# Altium project dose_io.PrjPCB
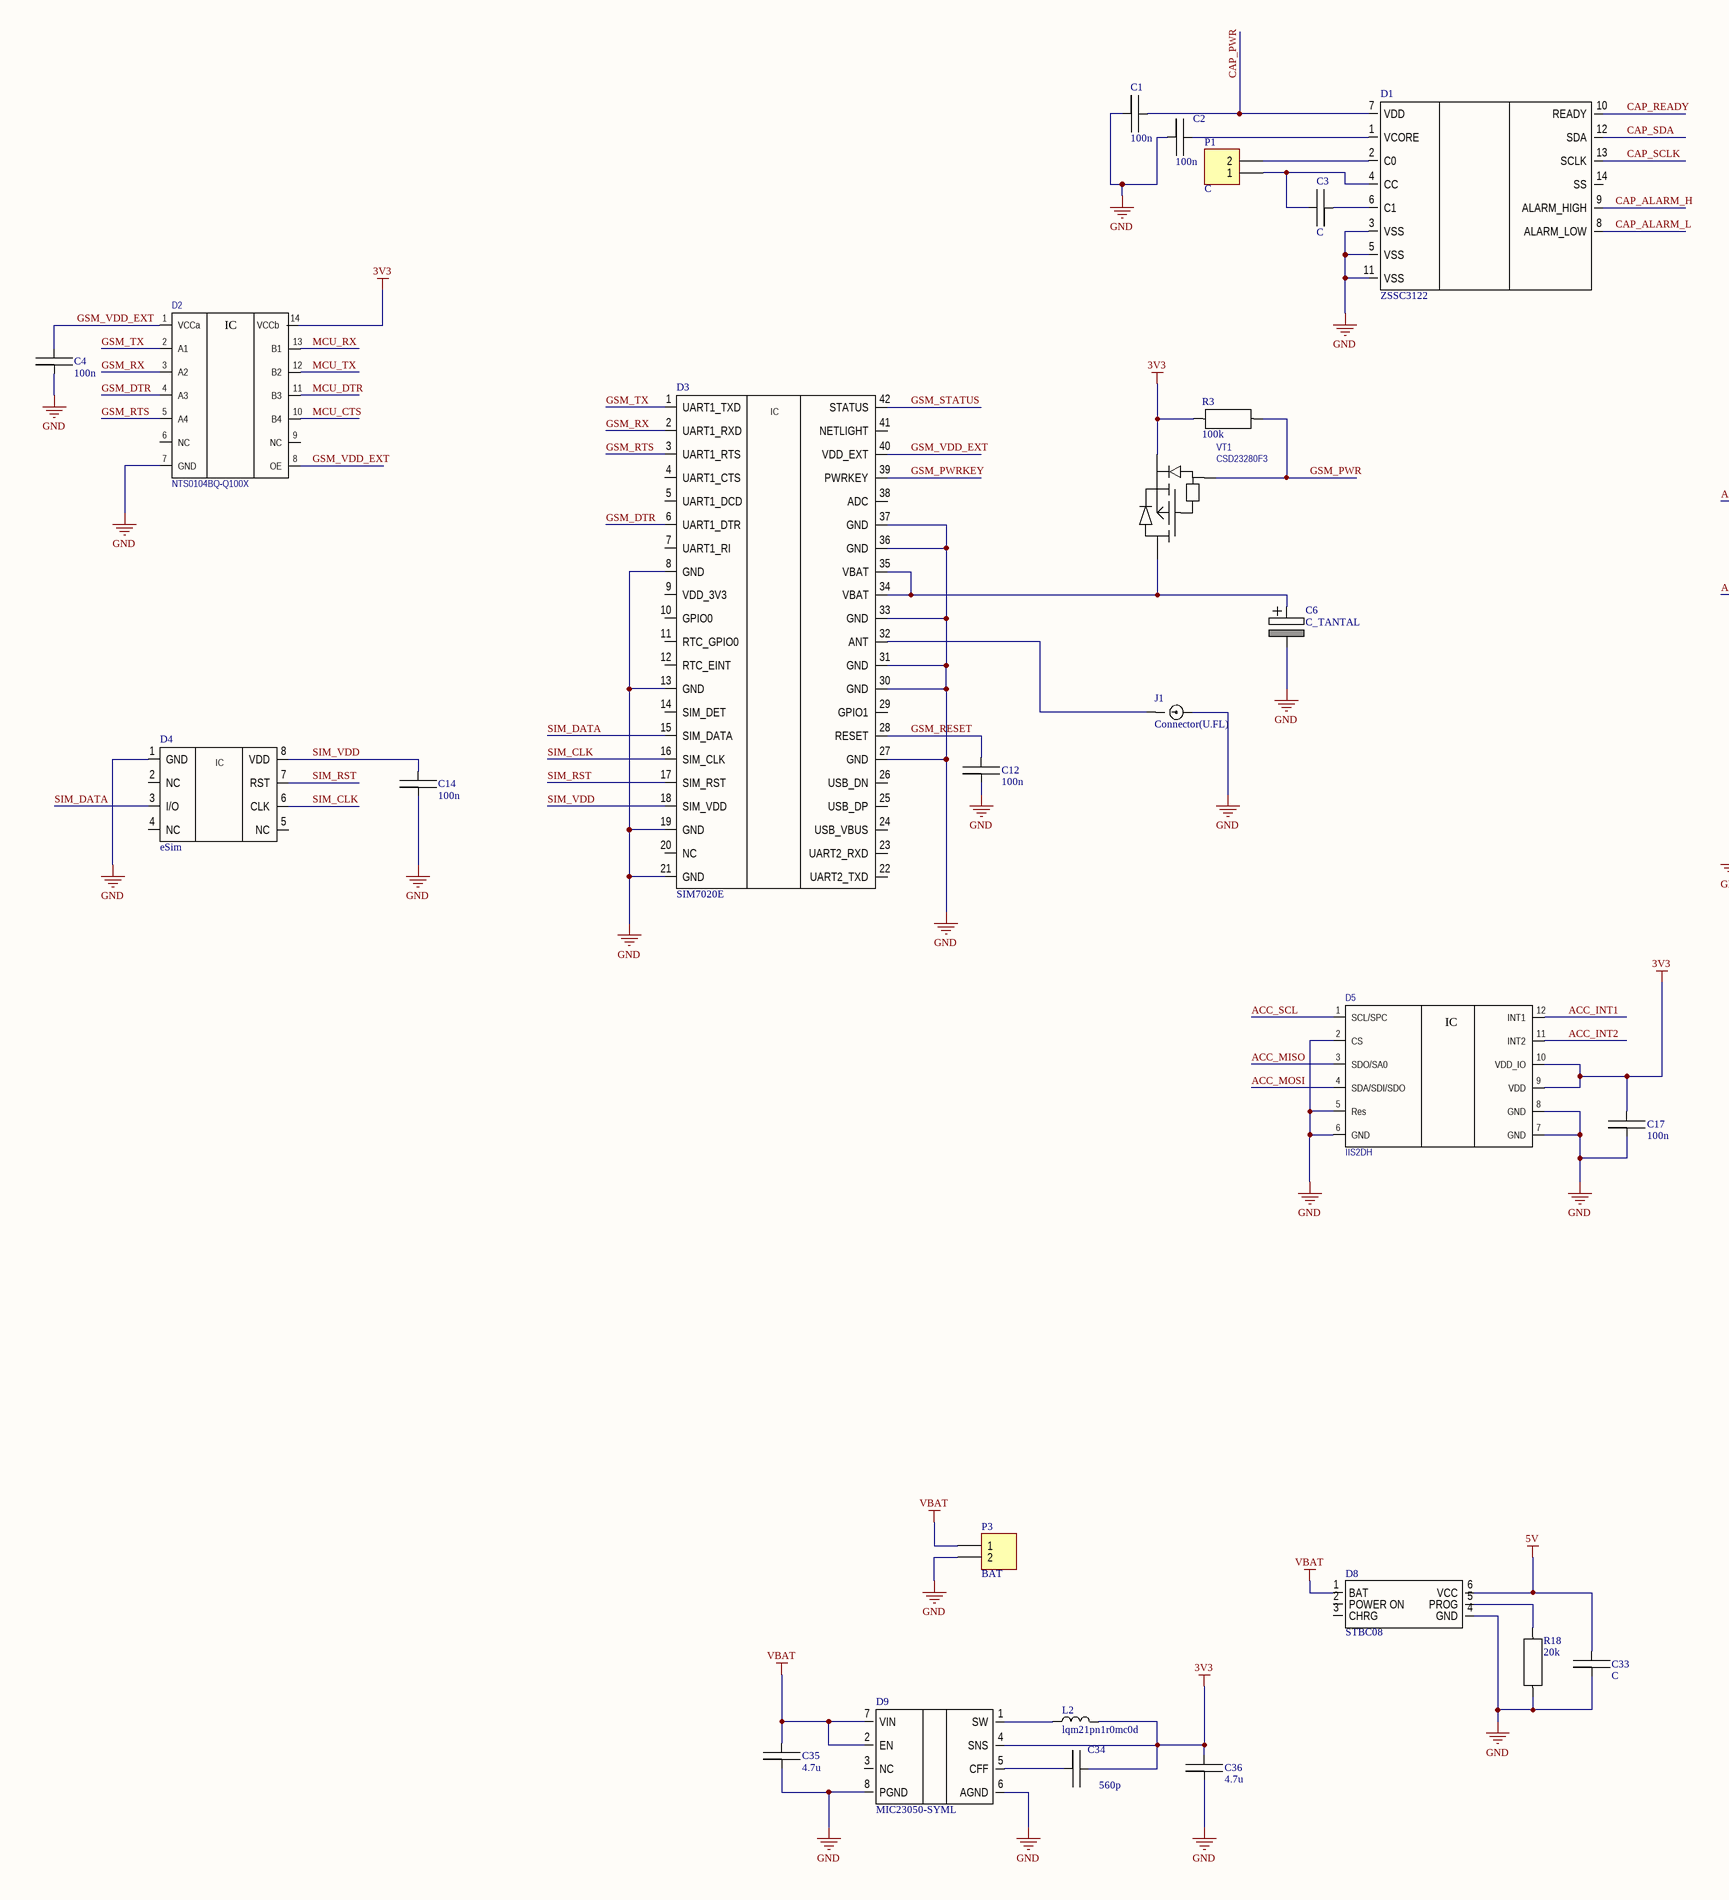
[diagram p0: Sheet_v1.SchDoc, left]
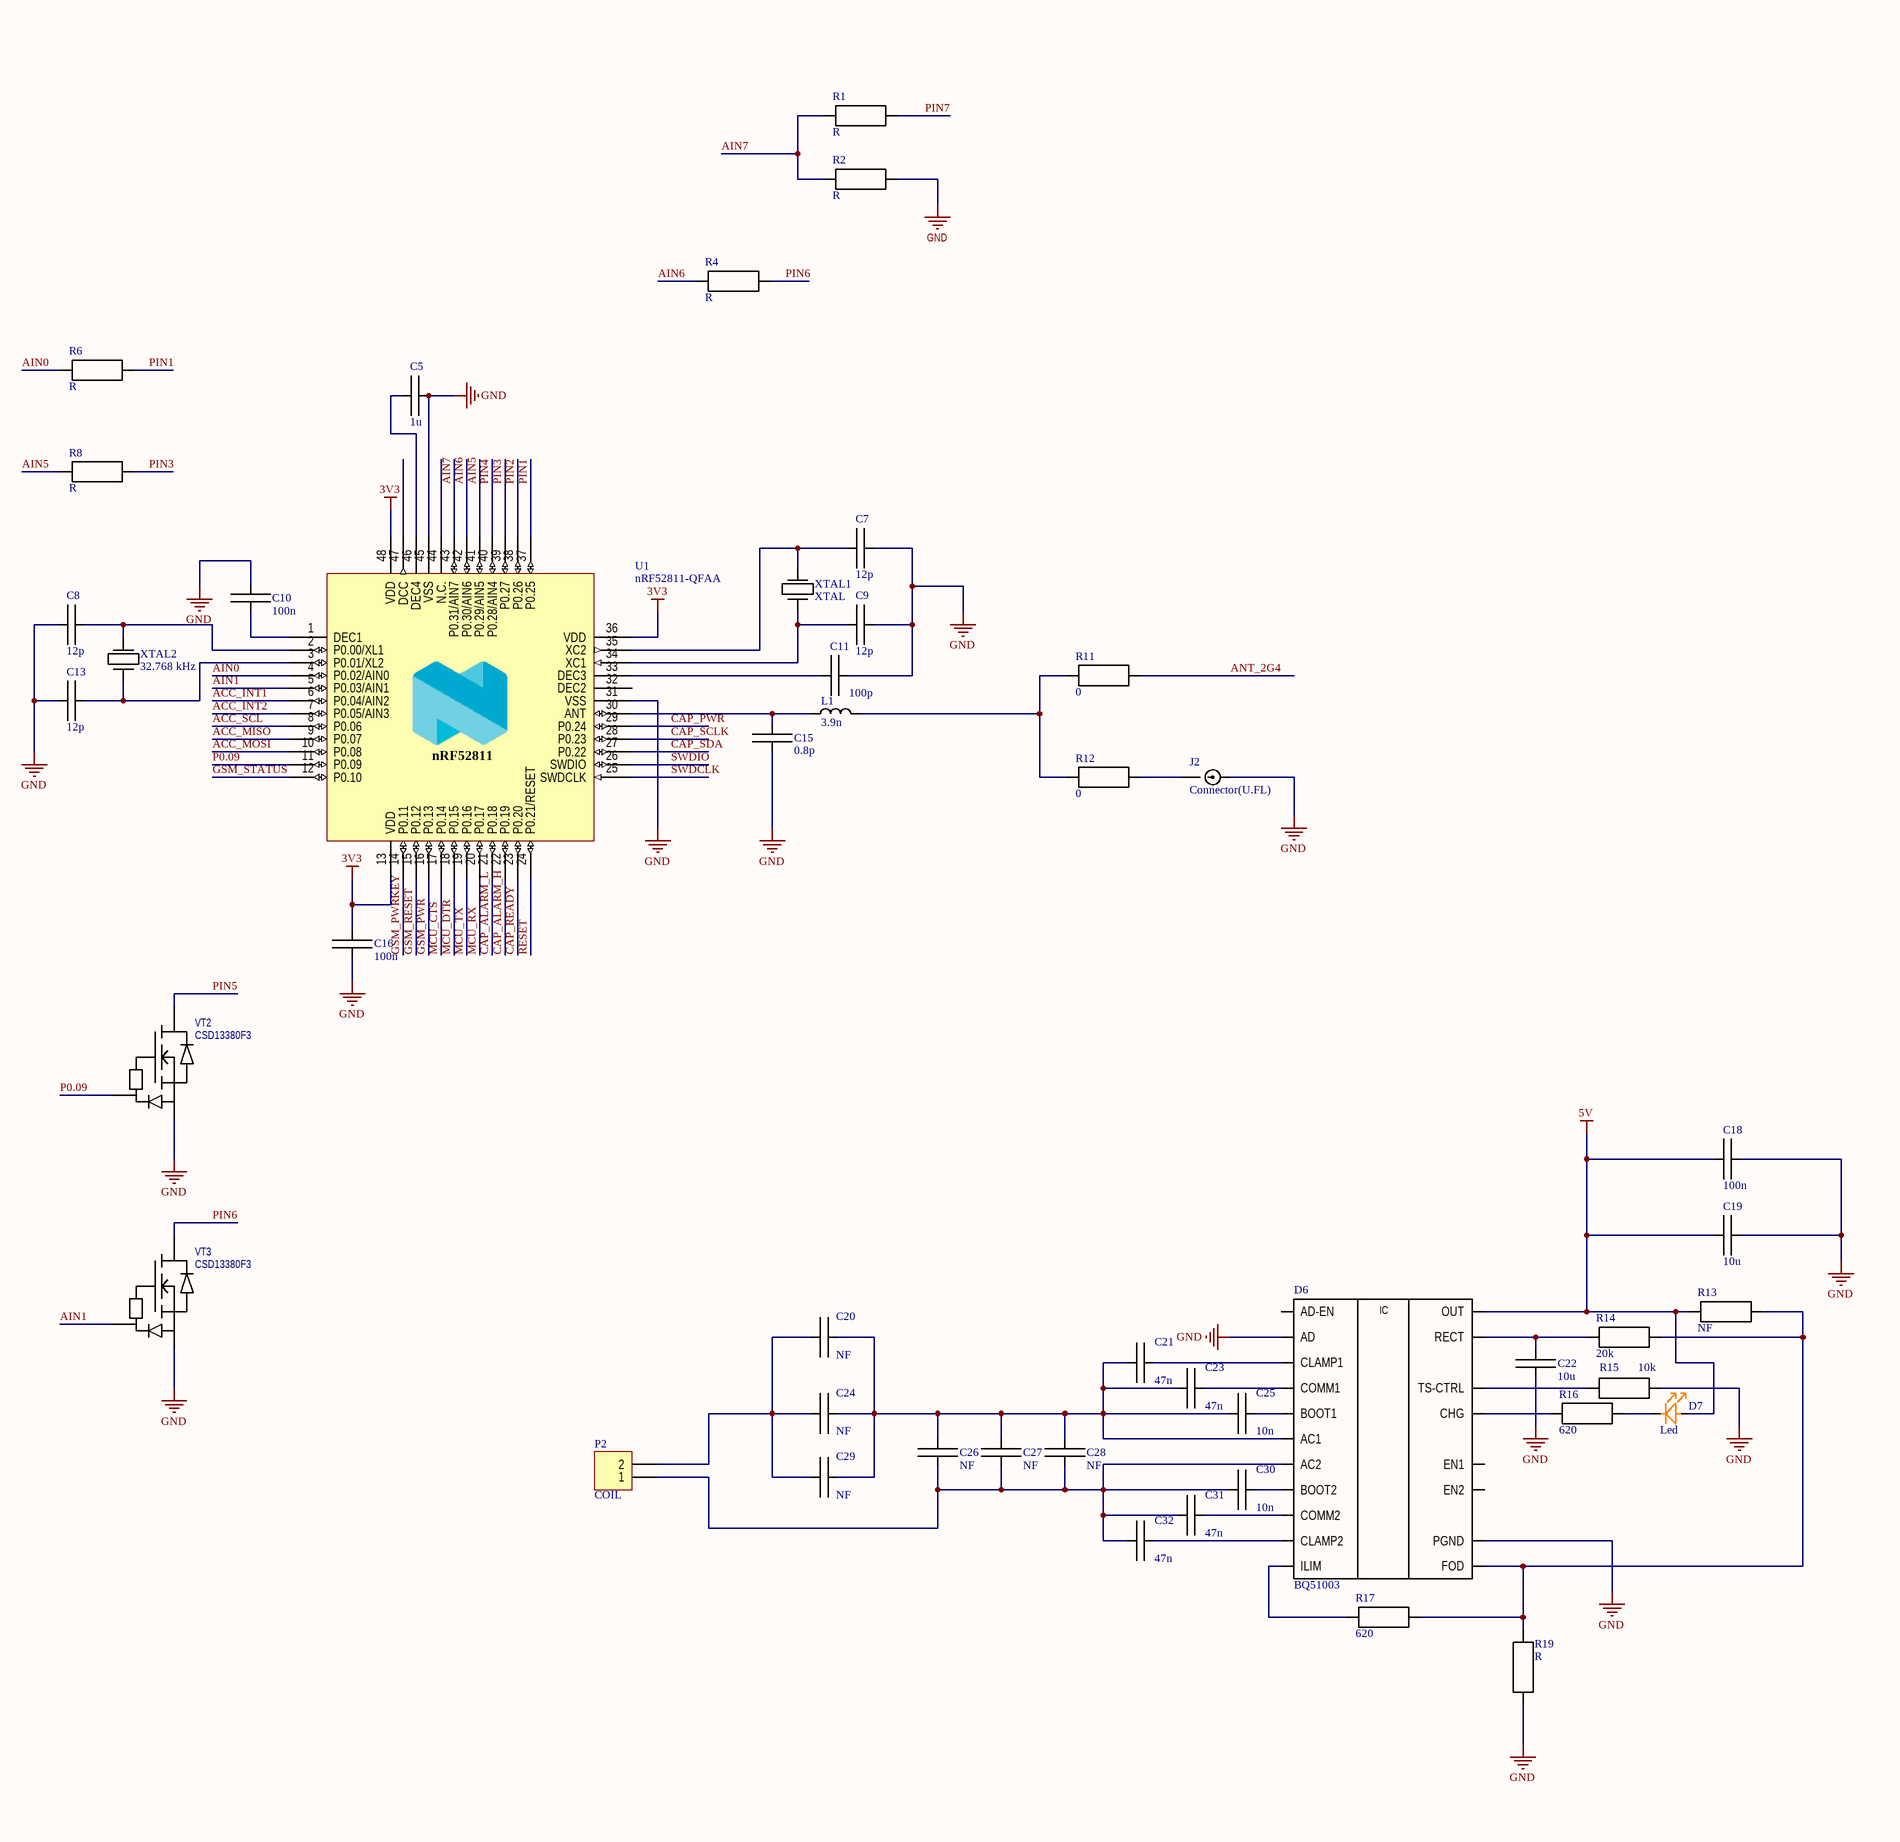
[diagram p1: Sheet_v1.SchDoc, right]
1 sheet, 73 parts. Net scope: global (net labels, ports and power ports of the same name join across sheets).
Board file: PCB_v1.PcbDoc

## Sheet Sheet_v1.SchDoc
size 840 x 594 mm; Address1: Address1; Address2: Address2; Address3: Address3; Address4: Address4; SheetNumber: 1; Scale: 1:1; Разраб.: Иванов; Обозначение документа: АБВГ.123456.001 Э3; Пров.: Петров; Утв.: Сидоров; Наименование организации: ОАО "Концерн "МПО-Гидроприбор"; Перв. применение: АБВГ.123456.000; Наименование изделия 1: Плата; Наименование изделия 2: Схема электрическая; Наименование изделия 3: принципиальная; Нач. отд.: Нач. отд.; Фамилия нач. отд.: Сидоров

### Parts
C1  100n  [C0402]
C2  100n  [C0402]
C3  C  [C0402]
C4  100n  [C0402]
C5  1u  [C0402]
C6  C_TANTAL  [C_TYPE_D]
C7  12p  [C0402]
C8  12p  [C0402]
C9  12p  [C0402]
C10  100n  [C0402]
C11  100p  [C0402]
C12  100n  [C0402]
C13  12p  [C0402]
C14  100n  [C0402]
C15  0.8p  [C0402]
C16  100n  [C0402]
C17  100n  [C0402]
C18  100n  [C0402]
C19  10u  [C0603]
C20  NF  [C0603]
C21  47n  [C0603]
C22  10u  [C0402]
C23  47n  [C0603]
C24  NF  [C0603]
C25  10n  [C0603]
C26  NF  [C0603]
C27  NF  [C0603]
C28  NF  [C0603]
C29  NF  [C0603]
C30  10n  [C0603]
C31  47n  [C0603]
C32  47n  [C0603]
C33  C  [C0402]
C34  560p  [C0402]
C35  4.7u  [C0805]
C36  4.7u  [C0805]
D1  ZSSC3122  [TSSOP14]
D2  NTS0104BQ-Q100X  [DHVQFN14]
D3  SIM7020E  [SIM7020E]
D4  eSim  [VQFN8]
D5  IIS2DH  [LGA12]
D6  BQ51003  [DSBGA]
D7  Led  [D0402(1006)]
D8  STBC08  [DFN6]
D9  MIC23050-SYML  [MLF8]
J1  Connector(U.FL)  [U.FL]
J2  Connector(U.FL)  [U.FL]
L1  3.9n  [L0402]
L2  lqm21pn1r0mc0d  [L0805]
P1  C  [HDR1X2]
P2  COIL  [HDR1X2]
P3  BAT  [HDR1X2]
R1  R  [R0402]
R2  R  [R0402]
R3  100k  [R0402]
R4  R  [R0402]
R6  R  [R0402]
R8  R  [R0402]
R11  0  [R0402]
R12  0  [R0402]
R13  NF  [R0402]
R14  20k  [R0402]
R15  10k  [R0402]
R16  620  [R0402]
R17  620  [R0402]
R18  20k  [R0402]
R19  R  [R0402]
U1  nRF52811-QFAA  [QFN40P600X600X90-48N]
VT1  CSD23280F3  [CSD13380F3]
VT2  CSD13380F3  [CSD13380F3]
VT3  CSD13380F3  [CSD13380F3]
XTAL1  XTAL  [NX2016SA]
XTAL2  32.768 kHz  [NX2012SA]

### Nets
3V3: C16.2 C17.2 C34.2 C36.2 D2.14(VCCb) D5.9(VDD) D5.10(VDD_IO) D9.4(SNS) L2.2 R3.1 U1.13(VDD) U1.36(VDD) U1.48(VDD) VT1.S
5V: C18.1 C19.2 C33.2 D6.OUT D7.2 D8.6(VCC) R13.1
GND: C1.1 C2.1 C4.1 C5.2 C6.2 C7.2 C8.1 C9.2 C10.2 C11.2 C12.1 C13.1 C14.1 C15.1 C16.1 C17.1 C18.2 C19.1 C22.1 C33.1 C35.1 C36.1 D1.3(VSS) D1.5(VSS) D1.11(VSS) D2.7(GND) D3.8(GND) D3.13(GND) D3.19(GND) D3.21(GND) D3.27(GND) D3.30(GND) D3.31(GND) D3.33(GND) D3.36(GND) D3.37(GND) D4.1(GND) D5.2(CS) D5.5(Res) D5.6(GND) D5.7(GND) D5.8(GND) D6.AD D6.PGND D8.4(GND) D9.6(AGND) D9.8(PGND) J1.2 J2.2 P3.2 R2.2 R15.1 R18.1 R19.1 U1.31(VSS) U1.45(VSS) U1.49(GND) VT2.S VT3.S
VBAT: C35.2 D8.1(BAT) D9.2(EN) D9.7(VIN) P3.1
ACC_INT1: D5.12(INT1) U1.6(P0.04/AIN2)
ACC_INT2: D5.11(INT2) U1.7(P0.05/AIN3)
ACC_MISO: D5.3(SDO/SA0) U1.9(P0.07)
ACC_MOSI: D5.4(SDA/SDI/SDO) U1.10(P0.08)
ACC_SCL: D5.1(SCL/SPC) U1.8(P0.06)
AIN0: R6.1 U1.4(P0.02/AIN0)
AIN1: U1.5(P0.03/AIN1) VT3.G
AIN5: R8.1 U1.41(P0.29/AIN5)
AIN6: R4.1 U1.42(P0.30/AIN6)
AIN7: R1.1 R2.1 U1.43(P0.31/AIN7)
ANT_2G4: R11.2
CAP_ALARM_H: D1.9(ALARM_HIGH) U1.22(P0.19)
CAP_ALARM_L: D1.8(ALARM_LOW) U1.21(P0.18)
CAP_PWR: C1.2 D1.7(VDD) U1.29(P0.24)
CAP_READY: D1.10(READY) U1.23(P0.20)
CAP_SCLK: D1.13(SCLK) U1.28(P0.23)
CAP_SDA: D1.12(SDA) U1.27(P0.22)
GSM_DTR: D2.4(A3) D3.6(UART1_DTR)
GSM_PWR: R3.2 U1.16(P0.13) VT1.G
GSM_PWRKEY: D3.39(PWRKEY) U1.14(P0.11)
GSM_RESET: C12.2 D3.28(RESET) U1.15(P0.12)
GSM_RTS: D2.5(A4) D3.3(UART1_RTS)
GSM_RX: D2.3(A2) D3.2(UART1_RXD)
GSM_STATUS: D3.42(STATUS) U1.12(P0.10)
GSM_TX: D2.2(A1) D3.1(UART1_TXD)
GSM_VDD_EXT: C4.2 D2.1(VCCa) D2.8(OE) D3.40(VDD_EXT)
MCU_CTS: D2.10(B4) U1.17(P0.14)
MCU_DTR: D2.11(B3) U1.18(P0.15)
MCU_RX: D2.13(B1) U1.20(P0.17)
MCU_TX: D2.12(B2) U1.19(P0.16)
P0.09: U1.11(P0.09) VT2.G
PIN1: R6.2 U1.37(P0.25)
PIN2: U1.38(P0.26)
PIN3: R8.2 U1.39(P0.27)
PIN4: U1.40(P0.28/AIN4)
PIN5: VT2.D
PIN6: R4.2 VT3.D
PIN7: R1.2
RESET: U1.24(P0.21/RESET)
SIM_CLK: D3.16(SIM_CLK) D4.6(CLK)
SIM_DATA: D3.15(SIM_DATA) D4.3(I/O)
SIM_RST: D3.17(SIM_RST) D4.7(RST)
SIM_VDD: C14.2 D3.18(SIM_VDD) D4.8(VDD)
SWDCLK: U1.25(SWDCLK)
SWDIO: U1.26(SWDIO)
NetC2_2: C2.2 D1.1(VCORE)
NetC3_1: C3.1 D1.6(C1)
NetC3_2: C3.2 D1.4(CC) P1.1
NetC5_1: C5.1 U1.46(DEC4)
NetC6_1: C6.1 D3.34(VBAT) D3.35(VBAT) VT1.D
NetC7_1: C7.1 U1.35(XC2) XTAL1.2
NetC8_2: C8.2 U1.2(P0.00/XL1) XTAL2.2
NetC9_1: C9.1 U1.34(XC1) XTAL1.1
NetC10_1: C10.1 U1.1(DEC1)
NetC11_1: C11.1 U1.33(DEC3)
NetC13_2: C13.2 U1.3(P0.01/XL2) XTAL2.1
NetC15_2: C15.2 L1.1 U1.30(ANT)
NetC20_1: C20.1 C21.1 C23.1 C24.1 C25.1 C26.2 C27.2 C28.2 C29.1 D6.AC1
NetC20_2: C20.2 C24.2 C29.2 P2.2
NetC21_2: C21.2 D6.CLAMP1
NetC22_2: C22.2 D6.RECT R14.1
NetC23_2: C23.2 D6.COMM1
NetC25_2: C25.2 D6.BOOT1
NetC26_1: C26.1 C27.1 C28.1 C30.1 C31.1 C32.1 D6.AC2 P2.1
NetC30_2: C30.2 D6.BOOT2
NetC31_2: C31.2 D6.COMM2
NetC32_2: C32.2 D6.CLAMP2
NetC34_1: C34.1 D9.5(CFF)
NetD1_2: D1.2(C0) P1.2
NetD3_32: D3.32(ANT) J1.1
NetD6_CHG: D6.CHG R16.1
NetD6_FOD: D6.FOD R13.2 R14.2 R17.2 R19.2
NetD6_ILIM: D6.ILIM R17.1
NetD6_TS-CTRL: D6.TS-CTRL R15.2
NetD7_1: D7.1 R16.2
NetD8_5: D8.5(PROG) R18.2
NetD9_1: D9.1(SW) L2.1
NetJ2_1: J2.1 R12.2
NetL1_2: L1.2 R11.1 R12.1

Not connected (* = marked no-connect by the designer): D1 14(SS); D2 6(NC) 9(NC); D3 4(UART1_CTS) 5(UART1_DCD) 7(UART1_RI) 9(VDD_3V3) 10(GPIO0) 11(RTC_GPIO0) 12(RTC_EINT) 14(SIM_DET) 20(NC) 22(UART2_TXD) 23(UART2_RXD) 24(USB_VBUS) 25(USB_DP) 26(USB_DN) 29(GPIO1) 38(ADC) 41(NETLIGHT); D4 2(NC) 4(NC) 5(NC); D6 AD-EN EN1 EN2; D8 2(POWER_ON) 3(CHRG); D9 3(NC); U1 32(DEC2) 44(N.C.) 47(DCC)

### Notes on the sheet
- Перв. примен.
- Справ. №
- Подп. и дата
- Инв. № дубл.
- Взам. инв. №
- Разраб.
- Изм.
- Лист
- № докум.
- Подп.
- Дата
- Лит.
- Масса
- Масштаб
- Пров.
- Т.контр.
- Листов
- Инв. № подл.
- Утв.
- Н.контр.
- Копировал
- Формат А1
- (in symbol BQ51003) IC
- (in symbol eSim) IC
- (in symbol IIS2DH) IC
- (in symbol nRF52811_QFAA) nRF52811
- (in symbol NTS0304) IC
- (in symbol SIM7020E) IC

### Library data of the parts
C1 C2 C4 C5 C7-C32 C34-C36 = C
D2 = NTS0304
L1 L2 = L
P1-P3 = Header 2: Header, 2-Pin; LatestRevisionDate: 17-Jul-2002; LatestRevisionNote: Re-released for DXP Platform.; Publisher: Altium Limited
R3 R11-R18 = R
U1 = nRF52811_QFAA: Multi-protocol Bluetooth Low Energy, IEEE 802.15.4, ANT and 2.4GHz proprietary system-on-chip; Part Number: nRF52811-QFAAA0; Manufacturer: Nordic Semiconductor; Manufacturer Part Number: nRF52811-QFAAA0; LatestRevisionDate: 2019-01-30; Pin Count: 48; Publisher: Nordic Semiconductor; Published: 2019-01-30; Value: nRF52811-QFAA; Footprint Doc: QFN-48